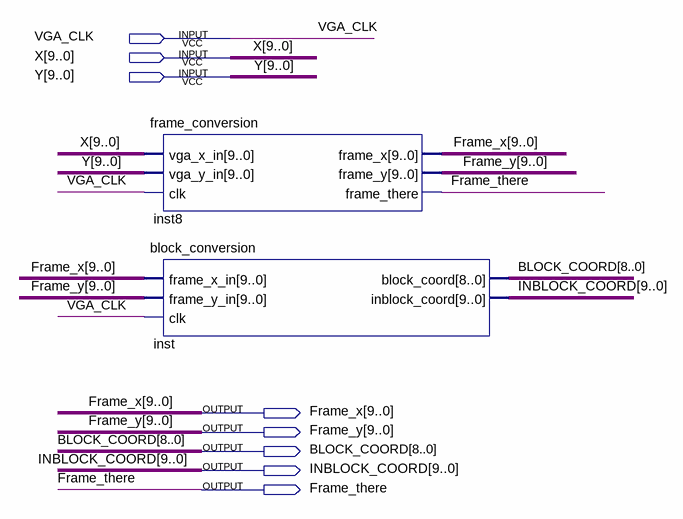
[diagram p0: schematic sheet]
// Quartus schematic frame_and_block_conversion.bdf as structural Verilog: 2 symbols, 8 pins
module frame_and_block_conversion (
  input  VGA_CLK,
  input  [9:0] X,
  input  [9:0] Y,
  output [9:0] Frame_x,
  output [9:0] Frame_y,
  output [8:0] BLOCK_COORD,
  output [9:0] INBLOCK_COORD,
  output Frame_there
);

  frame_conversion inst8 (
    .vga_x_in(X), .vga_y_in(Y), .clk(VGA_CLK), .frame_x(Frame_x), .frame_y(Frame_y), .frame_there(Frame_there));
  block_conversion inst (
    .frame_x_in(Frame_x), .frame_y_in(Frame_y), .clk(VGA_CLK), .block_coord(BLOCK_COORD),
    .inblock_coord(INBLOCK_COORD));
endmodule
